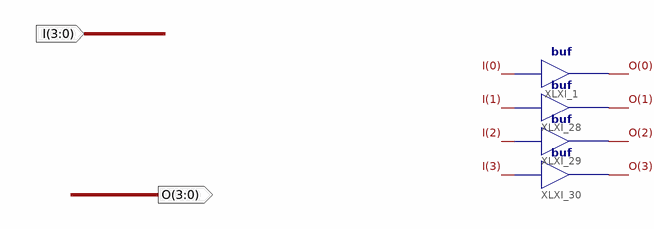
[diagram p0: schematic sheet 1]
// Xilinx ISE schematic buf4.sch (spartan3adsp) as structural Verilog: 4 symbols, 2 ports
module buf4 (
  input  [3:0] I,
  output [3:0] O
);

  buf XLXI_30 (O[3], I[3]);
  buf XLXI_29 (O[2], I[2]);
  buf XLXI_28 (O[1], I[1]);
  buf XLXI_1 (O[0], I[0]);
endmodule
